# EAGLE schematic DAC Shield (EAGLE 9.6.2)

## Sheet 1 of 2
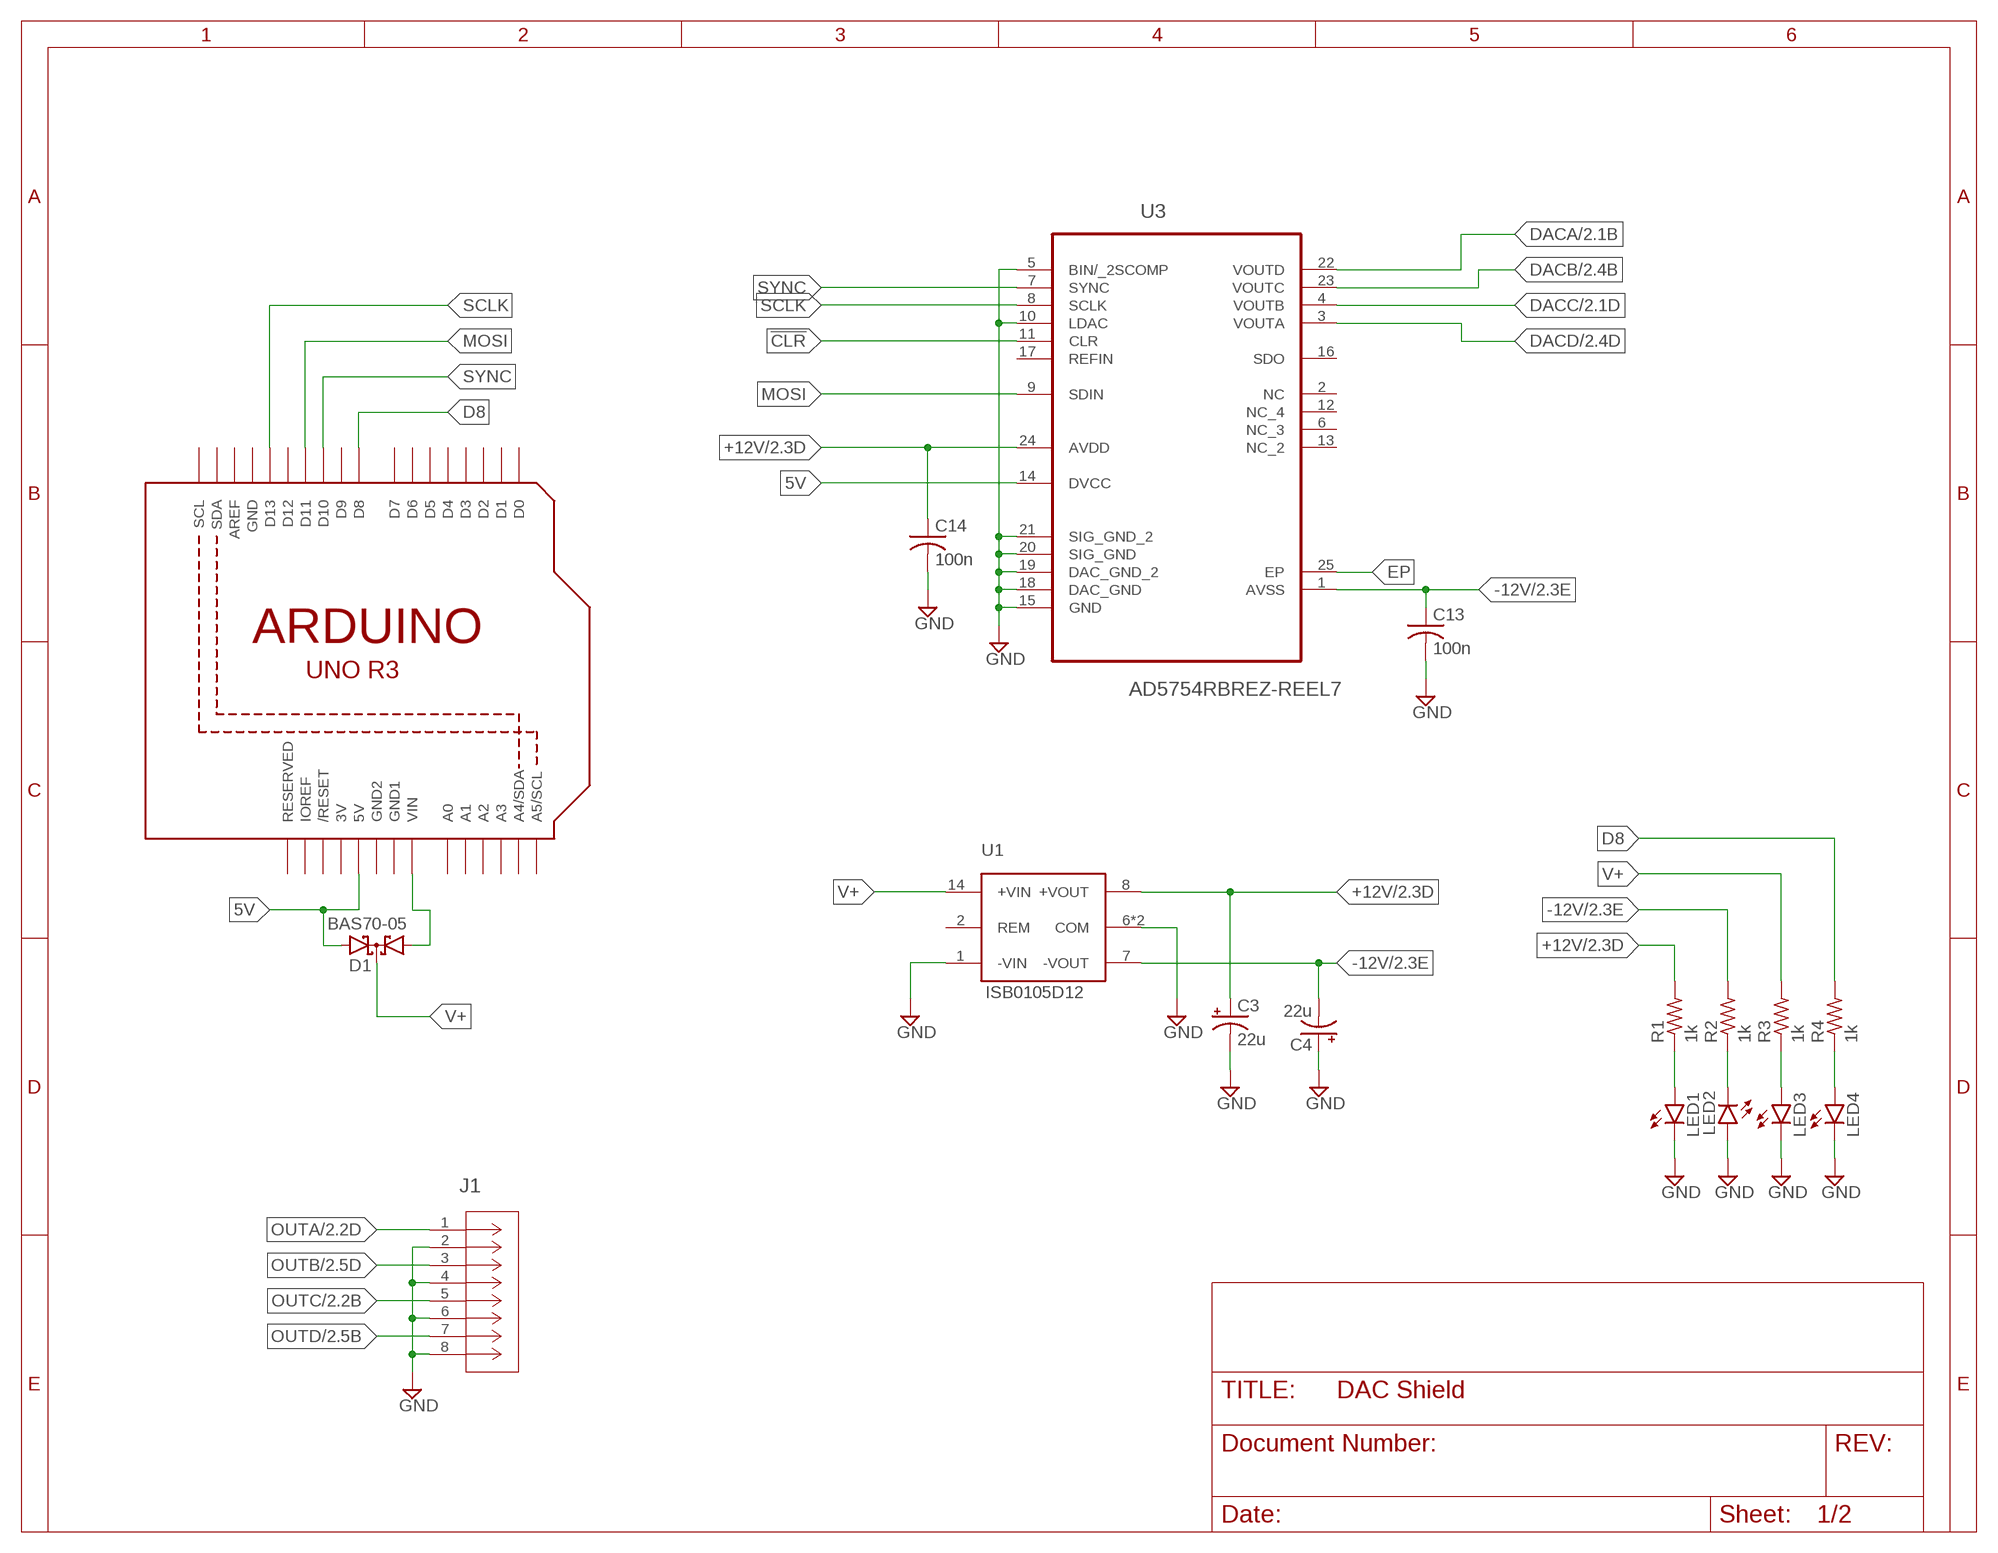
[diagram p0: schematic, sheet 1]

### Parts
C3  22u  CPOL-USC/6032-28W  [C/6032-28W]
C4  22u  CPOL-USC/6032-28W  [C/6032-28W]
C13  100n  C-USC0805  [C0805]
C14  100n  C-USC0805  [C0805]
D1  BAS70-05  [SOT23]
J1  OSTVN08A150  [CONN_OSTVN08A150_OST]
LED1  LEDCHIPLED_0805  [CHIPLED_0805]
LED2  LEDCHIPLED_0805  [CHIPLED_0805]
LED3  LEDCHIPLED_0805  [CHIPLED_0805]
LED4  LEDCHIPLED_0805  [CHIPLED_0805]
R1  1k  R-US_R0805  [R0805]
R2  1k  R-US_R0805  [R0805]
R3  1k  R-US_R0805  [R0805]
R4  1k  R-US_R0805  [R0805]
U1  ISB0105D12  ISB0105D12ISB0105D12  [SOP254P1860X845-14L]
U2  ARDUINOR3-BPLACE  [ARDUINOR3-BPLACE]
U3  AD5754RBREZ-REEL7  [SOP65P640X120-25N]

### Nets
5V: D1.2(A2) U2.5V U3.14(DVCC)
!CLR: U3.11(CLR)
+12V: C3.+ C14.1 R1.2 U1.8(+VOUT) U3.24(AVDD) ; also sheet 2
-12V: C4.- C13.1 R2.2 U1.7(-VOUT) U3.1(AVSS) ; also sheet 2
D8: R4.2 U2.D8
DACA: U3.22(VOUTD) ; also sheet 2
DACB: U3.23(VOUTC) ; also sheet 2
DACC: U3.4(VOUTB) ; also sheet 2
DACD: U3.3(VOUTA) ; also sheet 2
EP: U3.25(EP)
GND: C3.- C4.+ C13.2 C14.2 J1.2 J1.4 J1.6 J1.8 LED1.C LED2.A LED3.C LED4.C U1.1(-VIN) U1.6(COM) U1.9(COM) U3.5(BIN/_2SCOMP) U3.10(LDAC) U3.15(GND) U3.18(DAC_GND) U3.19(DAC_GND_2) U3.20(SIG_GND) U3.21(SIG_GND_2) ; also sheet 2
MOSI: U2.D11 U3.9(SDIN)
N$2: D1.1(A1) U2.VIN
N$12: LED1.A R1.1
N$13: LED2.C R2.1
N$14: LED3.A R3.1
N$15: LED4.A R4.1
OUTA: J1.1 ; also sheet 2
OUTB: J1.3 ; also sheet 2
OUTC: J1.5 ; also sheet 2
OUTD: J1.7 ; also sheet 2
SCLK: U2.D13 U3.8(SCLK)
SYNC: U2.D10 U3.7(SYNC)
V+: D1.3(C) R3.2 U1.14(+VIN)
Unconnected: U1.2(REM) U2.A0 U2.A1 U2.A2 U2.A3 U2.A4(A4/SDA) U2.A5(A5/SCL) U2.AREF U2.D0 U2.D1 U2.D2 U2.D3 U2.D4 U2.D5 U2.D6 U2.D7 U2.D9 U2.D12 U2.IOREF U2.RESERVED U2.RESET(/RESET) U2.SCL U2.SDA U3.2(NC) U3.6(NC_3) U3.12(NC_4) U3.13(NC_2) U3.16(SDO) U3.17(REFIN)

## Sheet 2 of 2
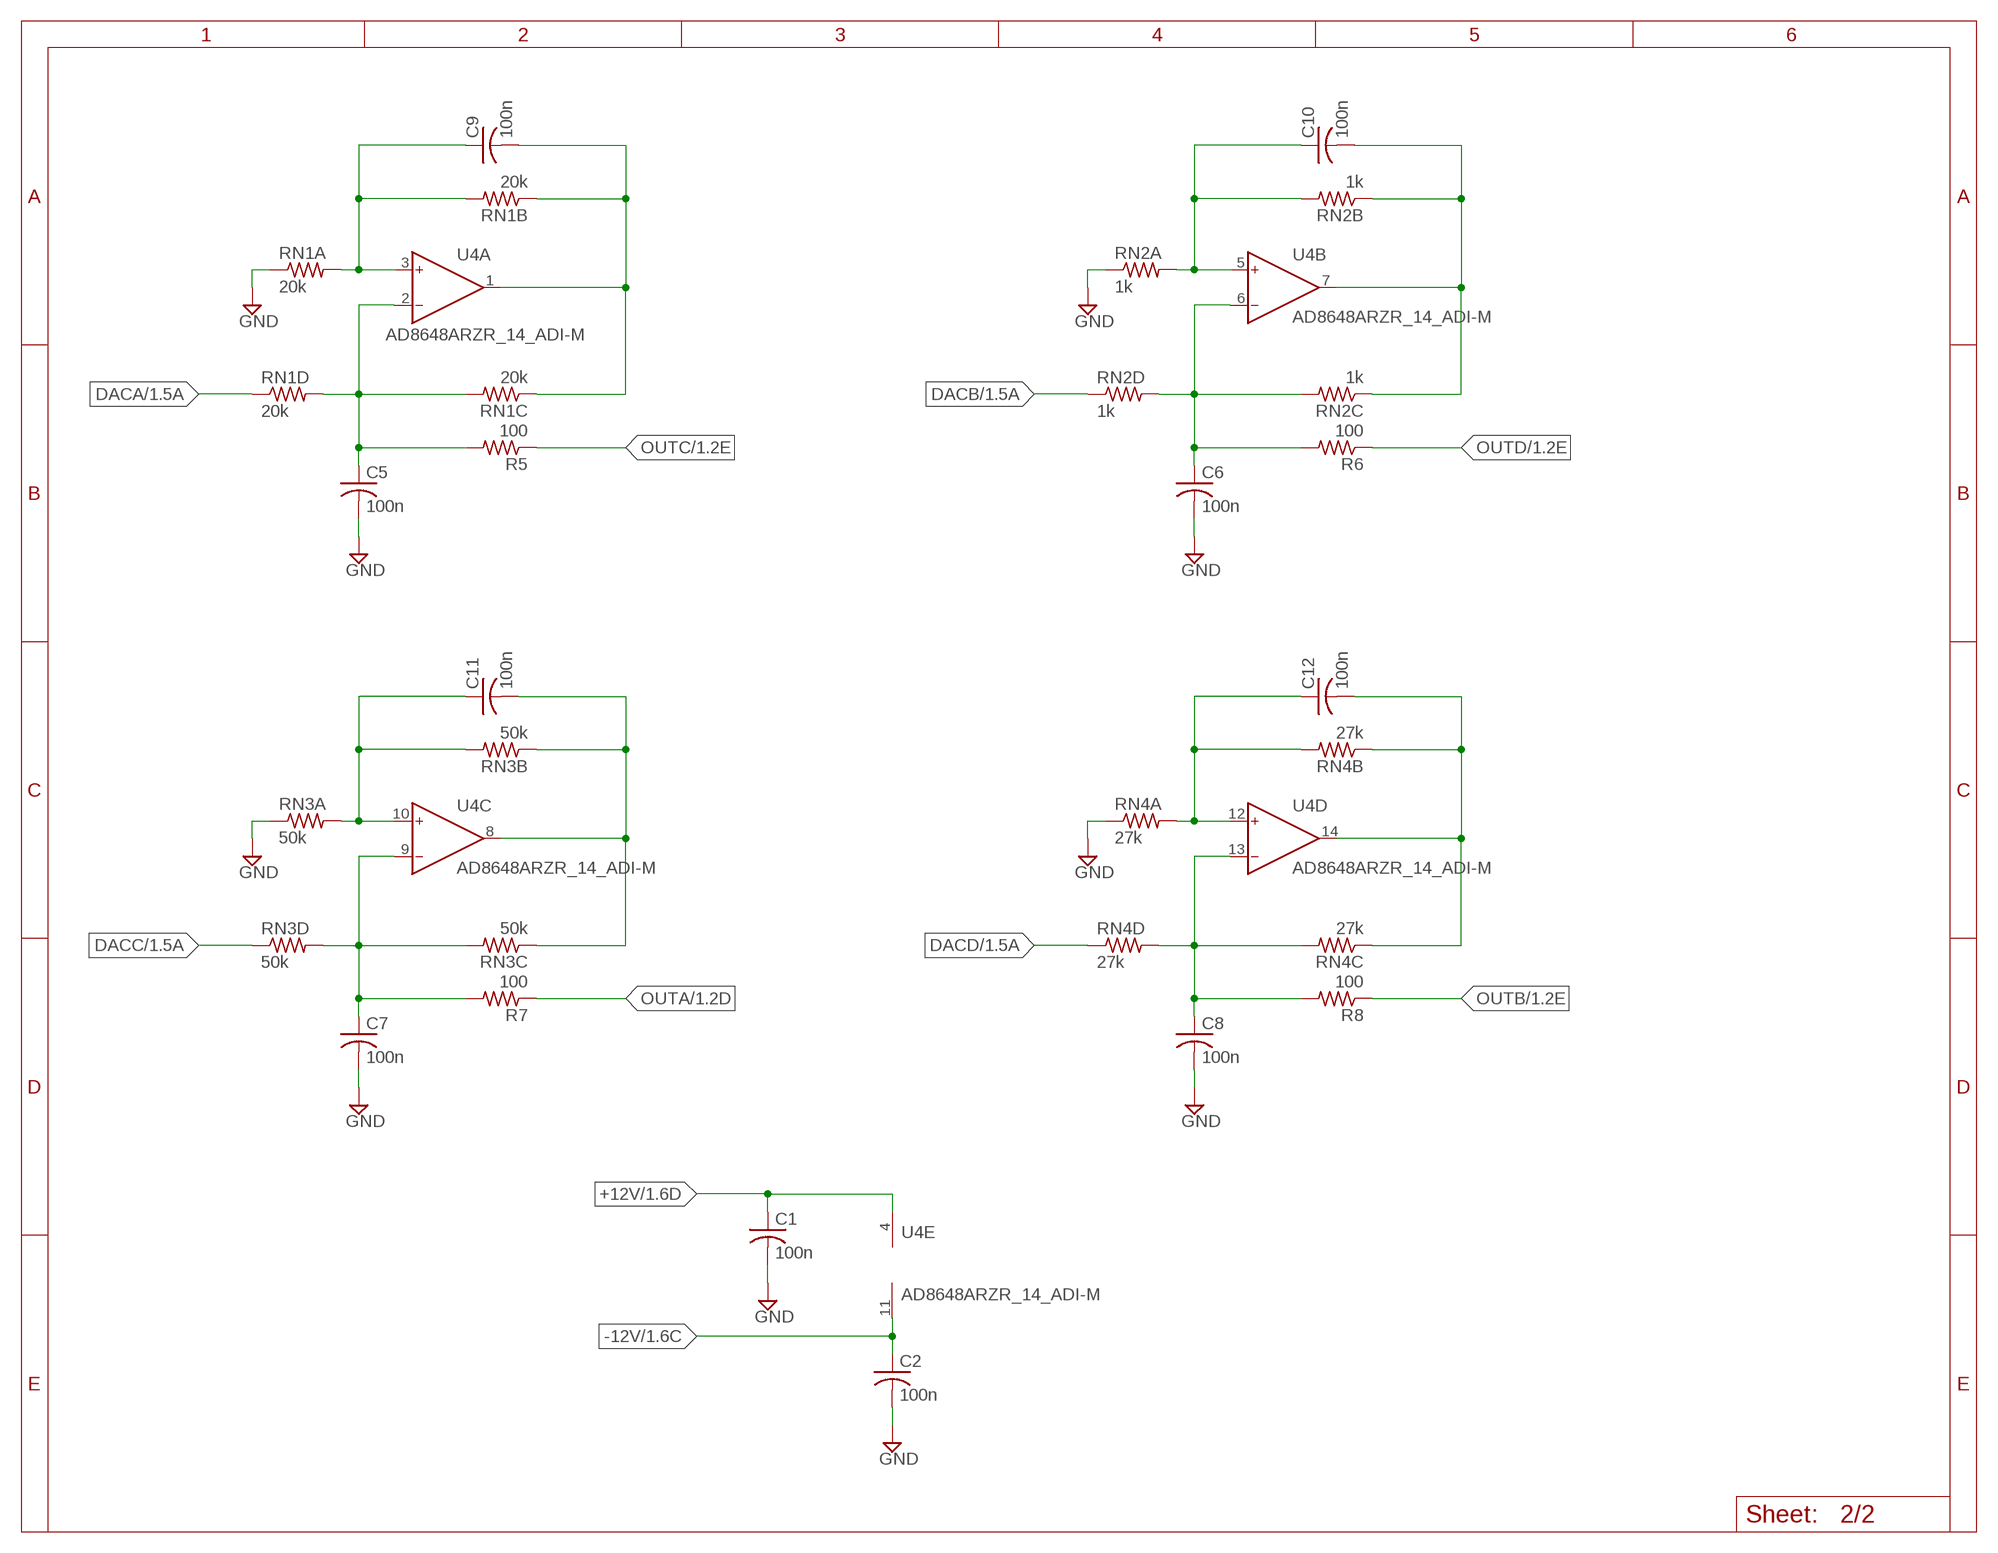
[diagram p1: schematic, sheet 2]

### Parts
C1  100n  C-USC0805  [C0805]
C2  100n  C-USC0805  [C0805]
C5  100n  C-USC0805  [C0805]
C6  100n  C-USC0805  [C0805]
C7  100n  C-USC0805  [C0805]
C8  100n  C-USC0805  [C0805]
C9  100n  C-USC0805  [C0805]
C10  100n  C-USC0805  [C0805]
C11  100n  C-USC0805  [C0805]
C12  100n  C-USC0805  [C0805]
R5  100  R-US_R0805  [R0805]
R6  100  R-US_R0805  [R0805]
R7  100  R-US_R0805  [R0805]
R8  100  R-US_R0805  [R0805]
RN1  20k  ACASA5001U5001P1ATACASA5001U5001P1AT  [RESCAV80P320X150X55-8N]
RN2  1k  ACASA5001U5001P1ATACASA5001U5001P1AT  [RESCAV80P320X150X55-8N]
RN3  50k  ACASA5001U5001P1ATACASA5001U5001P1AT  [RESCAV80P320X150X55-8N]
RN4  27k  ACASA5001U5001P1ATACASA5001U5001P1AT  [RESCAV80P320X150X55-8N]
U4  AD8648ARZR_14_ADI-M  [R_14_ADI-M]

### Nets
+12V: C1.1 U4.4(E:V+) ; also sheet 1
-12V: C2.1 U4.11(E:V-) ; also sheet 1
DACA: RN1.4 ; also sheet 1
DACB: RN2.4 ; also sheet 1
DACC: RN3.4 ; also sheet 1
DACD: RN4.4 ; also sheet 1
GND: C1.2 C2.2 C5.2 C6.2 C7.2 C8.2 RN1.1 RN2.1 RN3.1 RN4.1 ; also sheet 1
N$1: C10.1 RN2.7 RN2.8 U4.5(B:IN+)
N$3: C9.1 RN1.7 RN1.8 U4.3(A:IN+)
N$4: C9.2 RN1.2 RN1.3 U4.1(A:OUT)
N$5: C10.2 RN2.2 RN2.3 U4.7(B:OUT)
N$6: C11.1 RN3.7 RN3.8 U4.10(C:IN+)
N$7: C11.2 RN3.2 RN3.3 U4.8(C:OUT)
N$8: C12.1 RN4.7 RN4.8 U4.12(D:IN+)
N$9: C12.2 RN4.2 RN4.3 U4.14(D:OUT)
N$10: C5.1 R5.2 RN1.5 RN1.6 U4.2(A:IN-)
N$11: C6.1 R6.2 RN2.5 RN2.6 U4.6(B:IN-)
N$16: C7.1 R7.2 RN3.5 RN3.6 U4.9(C:IN-)
N$17: C8.1 R8.2 RN4.5 RN4.6 U4.13(D:IN-)
OUTA: R7.1 ; also sheet 1
OUTB: R8.1 ; also sheet 1
OUTC: R5.1 ; also sheet 1
OUTD: R6.1 ; also sheet 1

### Notes on the sheet
- Sheet:

## Power pins joined to a net without a drawn wire
3V: U2.3V
GND: U2.GND
GND1: U2.GND1
GND2: U2.GND2

## Library data of the parts
C1 C2 C5-C14 = rcl:C-US: CAPACITOR, American symbol
C3 C4 = rcl:CPOL-US: POLARIZED CAPACITOR, American symbol
D1 = diode:BAS70-05: Silicon Schottky Diodes General-purpose diode for high-speed switching
J1 = custom_connectors:OSTVN08A150; COPYRIGHT: Copyright (C) 2023 Ultra Librarian. All rights reserved.; MANUFACTURER_PART_NUMBER: OSTVN08A150; MFR_NAME: On Shore Technology
LED1-LED4 = led:LED: LED OSRAM: - CHIPLED LG R971, LG N971, LY N971, LG Q971, LY Q971, LO R971, LY R971 LH N974, LH R974 LS Q976, LO Q976, LY Q976 LO Q996 - Hyper CHIPLED LW Q18S LB Q993, LB Q99A, LB R99A - SideLED LS A670, LO A670, LY A670, LG A670, LP A670 LB A673, LV A673, LT A673, LW A673 LH A674 LY A675 LS A676, LA A676, LO A676, LY A676, LW A676 LS A679, LY A679, LG A679 - Hyper Micro SIDELED® LS Y876, LA Y876, LO Y876, LY Y876 LT Y87S - SmartLED LW L88C, LW L88S LB L89C, LB L89S, LG L890 LS L89K, LO L89K, LY L89K LS L896, LA L896, LO L896, LY L896 - TOPLED LS T670, LO T670, LY T670, LG T670, LP T670 LSG T670, LSP T670, LSY T670, LOP T670, LYG T670 LG T671, LOG T671, LSG T671 LB T673, LV T673, LT T673, LW T673 LH T674 LS T676, LA T676, LO T676, LY T676, LB T676, LH T676, LSB T676, LW T676 LB T67C, LV T67C, LT T67C, LS T67K, LO T67K, LY T67K, LW E67C LS E67B, LA E67B, LO E67B, LY E67B, LB E67C, LV E67C, LT E67C LW T67C LS T679, LY T679, LG T679 LS T770, LO T770, LY T770, LG T770, LP T770 LB T773, LV T773, LT T773, LW T773 LH T774 LS E675, LA E675, LY E675, LS T675 LS T776, LA T776, LO T776, LY T776, LB T776 LHGB T686 LT T68C, LB T68C - Hyper Mini TOPLED® LB M676 - Mini TOPLED Santana® LG M470 LS M47K, LO M47K, LY M47K Source: http://www.osram.convergy.de LUXEON: - LUMILED® LXK2-PW12-R00, LXK2-PW12-S00, LXK2-PW14-U00, LXK2-PW14-V00 LXK2-PM12-R00, LXK2-PM12-S00, LXK2-PM14-U00 LXK2-PE12-Q00, LXK2-PE12-R00, LXK2-PE12-S00, LXK2-PE14-T00, LXK2-PE14-U00 LXK2-PB12-K00, LXK2-PB12-L00, LXK2-PB12-M00, LXK2-PB14-N00, LXK2-PB14-P00, LXK2-PB14-Q00 LXK2-PR12-L00, LXK2-PR12-M00, LXK2-PR14-Q00, LXK2-PR14-R00 LXK2-PD12-Q00, LXK2-PD12-R00, LXK2-PD12-S00 LXK2-PH12-R00, LXK2-PH12-S00 LXK2-PL12-P00, LXK2-PL12-Q00, LXK2-PL12-R00 Source: www.luxeon.com KINGBRIGHT: KA-3528ASYC Source: www.kingbright.com
R1-R8 = rcl:R-US_: RESISTOR, American symbol
RN1-RN4 = rcl:ACASA5001U5001P1AT
U1 = DC-DC:ISB0105D12
U2 = adafruit:ARDUINOR3: This is a new object for the new Arduino R3 - with extra pins that you may want to use (such as IOref, and duplicated A4/A5
U3 = AD5754RBREZ-REEL7:AD5754RBREZ-REEL7: IC, DAC, 16BIT, 100KSPS; MPN: AD5754RBREZ-REEL7; OC_FARNELL: 1776675; OC_NEWARK: 07P8940; PACKAGE: 24-Lead TSSOP_EP; SUPPLIER: Analog Devices
U4 = analog:AD8648ARZ; COPYRIGHT: Copyright (C) 2023 Ultra Librarian. All rights reserved.; MANUFACTURER_PART_NUMBER: AD8648ARZ; MFR_NAME: Analog Devices Inc